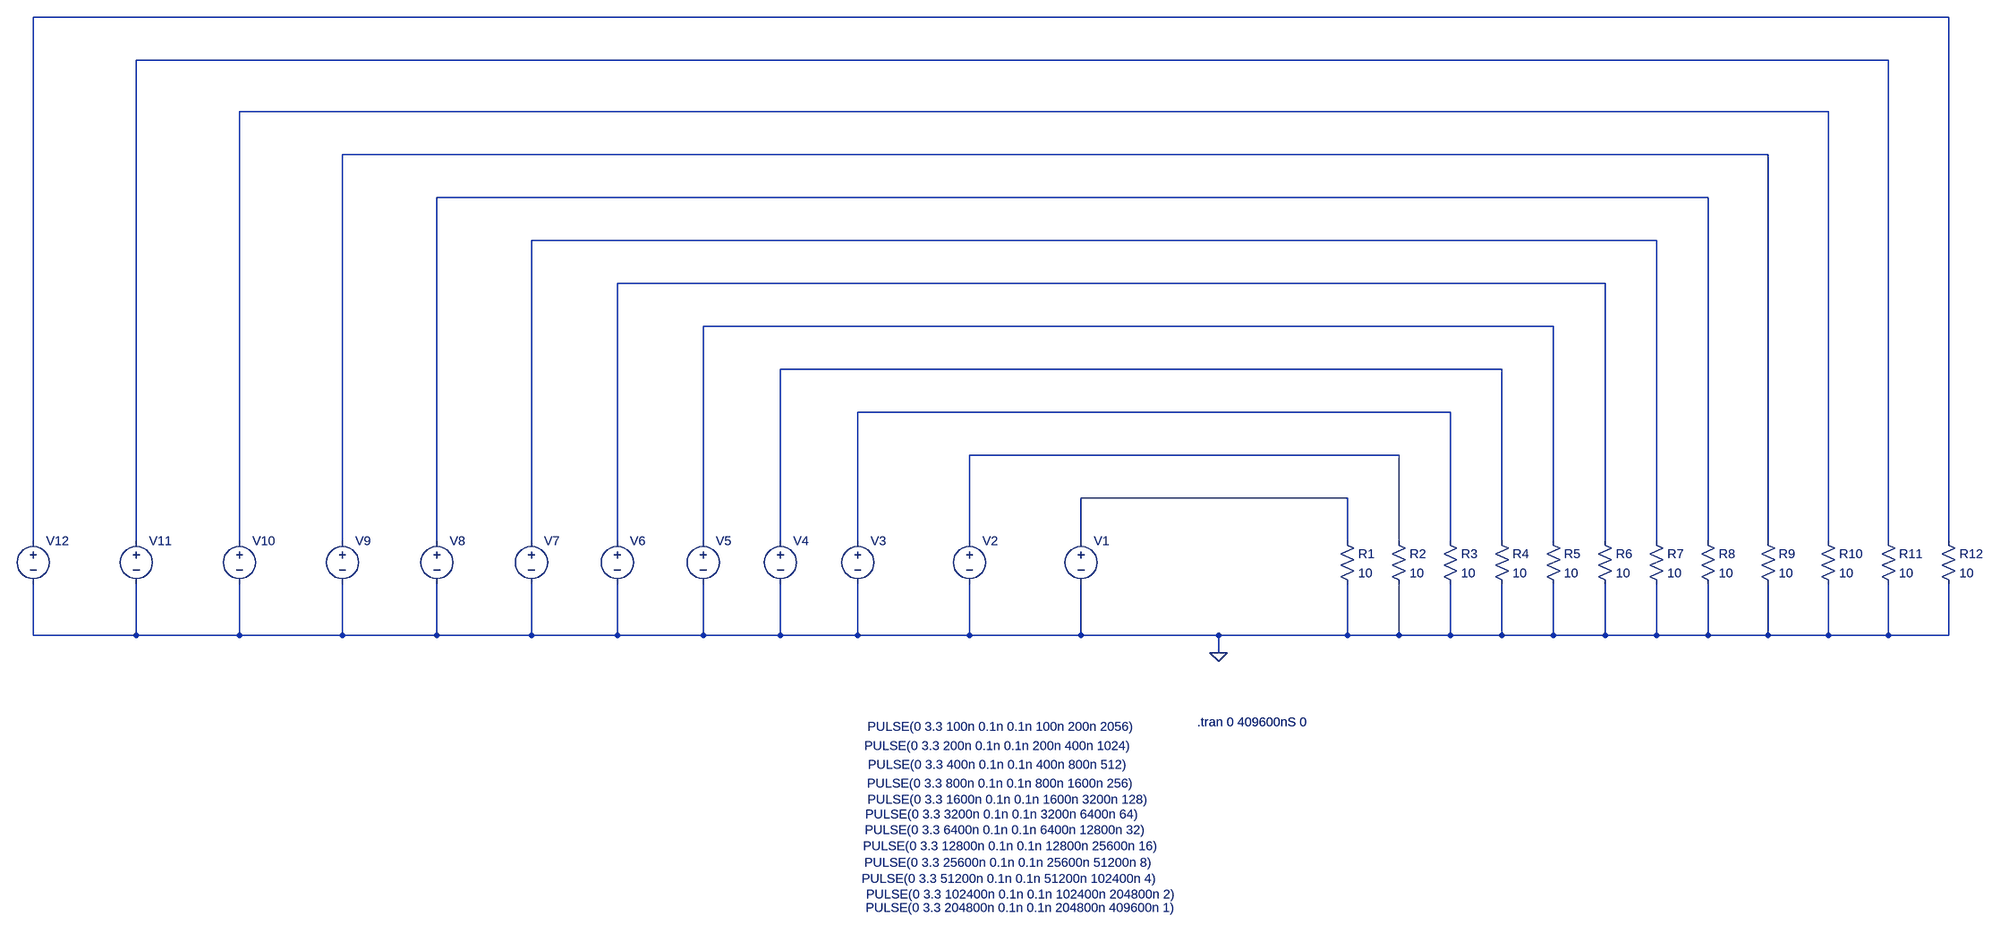
[diagram p0: schematic 12 input stimulus.asc]
12 input stimulus.asc, the LTspice schematic file:
Version 4
SHEET 1 1604 872
WIRE 1536 -832 -2032 -832
WIRE 1424 -752 -1840 -752
WIRE 1312 -656 -1648 -656
WIRE 1200 -576 -1456 -576
WIRE 1088 -496 -1280 -496
WIRE 992 -416 -1104 -416
WIRE 896 -336 -944 -336
WIRE 800 -256 -784 -256
WIRE 704 -176 -640 -176
WIRE 608 -96 -496 -96
WIRE 512 -16 -288 -16
WIRE 416 64 -80 64
WIRE -2032 144 -2032 -832
WIRE -1840 144 -1840 -752
WIRE -1648 144 -1648 -656
WIRE -1456 144 -1456 -576
WIRE -1280 144 -1280 -496
WIRE -1104 144 -1104 -416
WIRE -944 144 -944 -336
WIRE -784 144 -784 -256
WIRE -640 144 -640 -176
WIRE -496 144 -496 -96
WIRE -288 144 -288 -16
WIRE -80 144 -80 64
WIRE 416 144 416 64
WIRE 512 144 512 -16
WIRE 608 144 608 -96
WIRE 704 144 704 -176
WIRE 800 144 800 -256
WIRE 896 144 896 -336
WIRE 992 144 992 -416
WIRE 1088 144 1088 -496
WIRE 1200 144 1200 -576
WIRE 1312 144 1312 -656
WIRE 1424 144 1424 -752
WIRE 1536 144 1536 -832
WIRE -2032 320 -2032 224
WIRE -1840 320 -1840 224
WIRE -1840 320 -2032 320
WIRE -1648 320 -1648 224
WIRE -1648 320 -1840 320
WIRE -1456 320 -1456 224
WIRE -1456 320 -1648 320
WIRE -1280 320 -1280 224
WIRE -1280 320 -1456 320
WIRE -1104 320 -1104 224
WIRE -1104 320 -1280 320
WIRE -944 320 -944 224
WIRE -944 320 -1104 320
WIRE -784 320 -784 224
WIRE -784 320 -944 320
WIRE -640 320 -640 224
WIRE -640 320 -784 320
WIRE -496 320 -496 224
WIRE -496 320 -640 320
WIRE -288 320 -288 224
WIRE -288 320 -496 320
WIRE -80 320 -80 224
WIRE -80 320 -288 320
WIRE 176 320 -80 320
WIRE 416 320 416 224
WIRE 416 320 176 320
WIRE 512 320 512 224
WIRE 512 320 416 320
WIRE 608 320 608 224
WIRE 608 320 512 320
WIRE 704 320 704 224
WIRE 704 320 608 320
WIRE 800 320 800 224
WIRE 800 320 704 320
WIRE 896 320 896 224
WIRE 896 320 800 320
WIRE 992 320 992 224
WIRE 992 320 896 320
WIRE 1088 320 1088 224
WIRE 1088 320 992 320
WIRE 1200 320 1200 224
WIRE 1200 320 1088 320
WIRE 1312 320 1312 224
WIRE 1312 320 1200 320
WIRE 1424 320 1424 224
WIRE 1424 320 1312 320
WIRE 1536 320 1536 224
WIRE 1536 320 1424 320
WIRE 176 352 176 320
FLAG 176 352 0
SYMBOL res 400 128 R0
SYMATTR InstName R1
SYMATTR Value 10
SYMBOL voltage -80 128 R0
WINDOW 3 -398 368 Left 2
SYMATTR InstName V1
SYMATTR Value PULSE(0 3.3 100n 0.1n 0.1n 100n 200n 2056)
SYMBOL voltage -288 128 R0
WINDOW 3 -196 404 Left 2
SYMATTR InstName V2
SYMATTR Value PULSE(0 3.3 200n 0.1n 0.1n 200n 400n 1024)
SYMBOL res 496 128 R0
SYMATTR InstName R2
SYMATTR Value 10
SYMBOL res 592 128 R0
SYMATTR InstName R3
SYMATTR Value 10
SYMBOL voltage -496 128 R0
WINDOW 3 19 439 Left 2
SYMATTR InstName V3
SYMATTR Value PULSE(0 3.3 400n 0.1n 0.1n 400n 800n 512)
SYMBOL voltage -640 128 R0
WINDOW 3 161 474 Left 2
SYMATTR InstName V4
SYMATTR Value PULSE(0 3.3 800n 0.1n 0.1n 800n 1600n 256)
SYMBOL voltage -784 128 R0
WINDOW 3 306 504 Left 2
SYMATTR InstName V5
SYMATTR Value PULSE(0 3.3 1600n 0.1n 0.1n 1600n 3200n 128)
SYMBOL voltage -944 128 R0
WINDOW 3 462 532 Left 2
SYMATTR InstName V6
SYMATTR Value PULSE(0 3.3 3200n 0.1n 0.1n 3200n 6400n 64)
SYMBOL voltage -1104 128 R0
WINDOW 3 621 561 Left 2
SYMATTR InstName V7
SYMATTR Value PULSE(0 3.3 6400n 0.1n 0.1n 6400n 12800n 32)
SYMBOL voltage -1280 128 R0
WINDOW 3 794 591 Left 2
SYMATTR InstName V8
SYMATTR Value PULSE(0 3.3 12800n 0.1n 0.1n 12800n 25600n 16)
SYMBOL voltage -1456 128 R0
WINDOW 3 972 622 Left 2
SYMATTR InstName V9
SYMATTR Value PULSE(0 3.3 25600n 0.1n 0.1n 25600n 51200n 8)
SYMBOL voltage -1648 128 R0
WINDOW 3 1159 652 Left 2
SYMATTR InstName V10
SYMATTR Value PULSE(0 3.3 51200n 0.1n 0.1n 51200n 102400n 4)
SYMBOL voltage -1840 128 R0
WINDOW 3 1360 681 Left 2
SYMATTR InstName V11
SYMATTR Value PULSE(0 3.3 102400n 0.1n 0.1n 102400n 204800n 2)
SYMBOL voltage -2032 128 R0
WINDOW 3 1551 706 Left 2
SYMATTR InstName V12
SYMATTR Value PULSE(0 3.3 204800n 0.1n 0.1n 204800n 409600n 1)
SYMBOL res 688 128 R0
SYMATTR InstName R4
SYMATTR Value 10
SYMBOL res 784 128 R0
SYMATTR InstName R5
SYMATTR Value 10
SYMBOL res 880 128 R0
SYMATTR InstName R6
SYMATTR Value 10
SYMBOL res 976 128 R0
SYMATTR InstName R7
SYMATTR Value 10
SYMBOL res 1072 128 R0
SYMATTR InstName R8
SYMATTR Value 10
SYMBOL res 1184 128 R0
SYMATTR InstName R9
SYMATTR Value 10
SYMBOL res 1296 128 R0
SYMATTR InstName R10
SYMATTR Value 10
SYMBOL res 1408 128 R0
SYMATTR InstName R11
SYMATTR Value 10
SYMBOL res 1520 128 R0
SYMATTR InstName R12
SYMATTR Value 10
TEXT 136 488 Left 2 !.tran 0 409600nS 0

The netlist it stands for:
* 12 input stimulus.asc
R1 N012 0 10
V1 N012 0 PULSE(0 3.3 100n 0.1n 0.1n 100n 200n 2056)
V2 N011 0 PULSE(0 3.3 200n 0.1n 0.1n 200n 400n 1024)
R2 N011 0 10
R3 N010 0 10
V3 N010 0 PULSE(0 3.3 400n 0.1n 0.1n 400n 800n 512)
V4 N009 0 PULSE(0 3.3 800n 0.1n 0.1n 800n 1600n 256)
V5 N008 0 PULSE(0 3.3 1600n 0.1n 0.1n 1600n 3200n 128)
V6 N007 0 PULSE(0 3.3 3200n 0.1n 0.1n 3200n 6400n 64)
V7 N006 0 PULSE(0 3.3 6400n 0.1n 0.1n 6400n 12800n 32)
V8 N005 0 PULSE(0 3.3 12800n 0.1n 0.1n 12800n 25600n 16)
V9 N004 0 PULSE(0 3.3 25600n 0.1n 0.1n 25600n 51200n 8)
V10 N003 0 PULSE(0 3.3 51200n 0.1n 0.1n 51200n 102400n 4)
V11 N002 0 PULSE(0 3.3 102400n 0.1n 0.1n 102400n 204800n 2)
V12 N001 0 PULSE(0 3.3 204800n 0.1n 0.1n 204800n 409600n 1)
R4 N009 0 10
R5 N008 0 10
R6 N007 0 10
R7 N006 0 10
R8 N005 0 10
R9 N004 0 10
R10 N003 0 10
R11 N002 0 10
R12 N001 0 10
.tran 0 409600nS 0
.backanno
.end